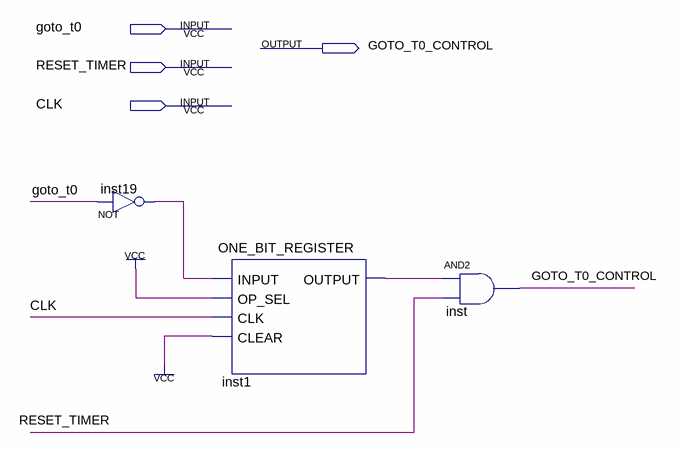
[diagram p0: schematic sheet]
// Quartus schematic GOTO_T0_CONTROLLER.bdf as structural Verilog: 3 symbols, 4 pins
module GOTO_T0_CONTROLLER (
  input  goto_t0,
  input  RESET_TIMER,
  input  CLK,
  output GOTO_T0_CONTROL
);

  wire inst1_output, inst19_out;

  not inst19 (inst19_out, goto_t0);
  ONE_BIT_REGISTER inst1 (.INPUT(inst19_out), .OP_SEL(1'b1), .CLK(CLK), .CLEAR(1'b1), .OUTPUT(inst1_output));
  and inst (GOTO_T0_CONTROL, inst1_output, RESET_TIMER);
endmodule
